# EAGLE design shield-no_ps (EAGLE 6.5.0)
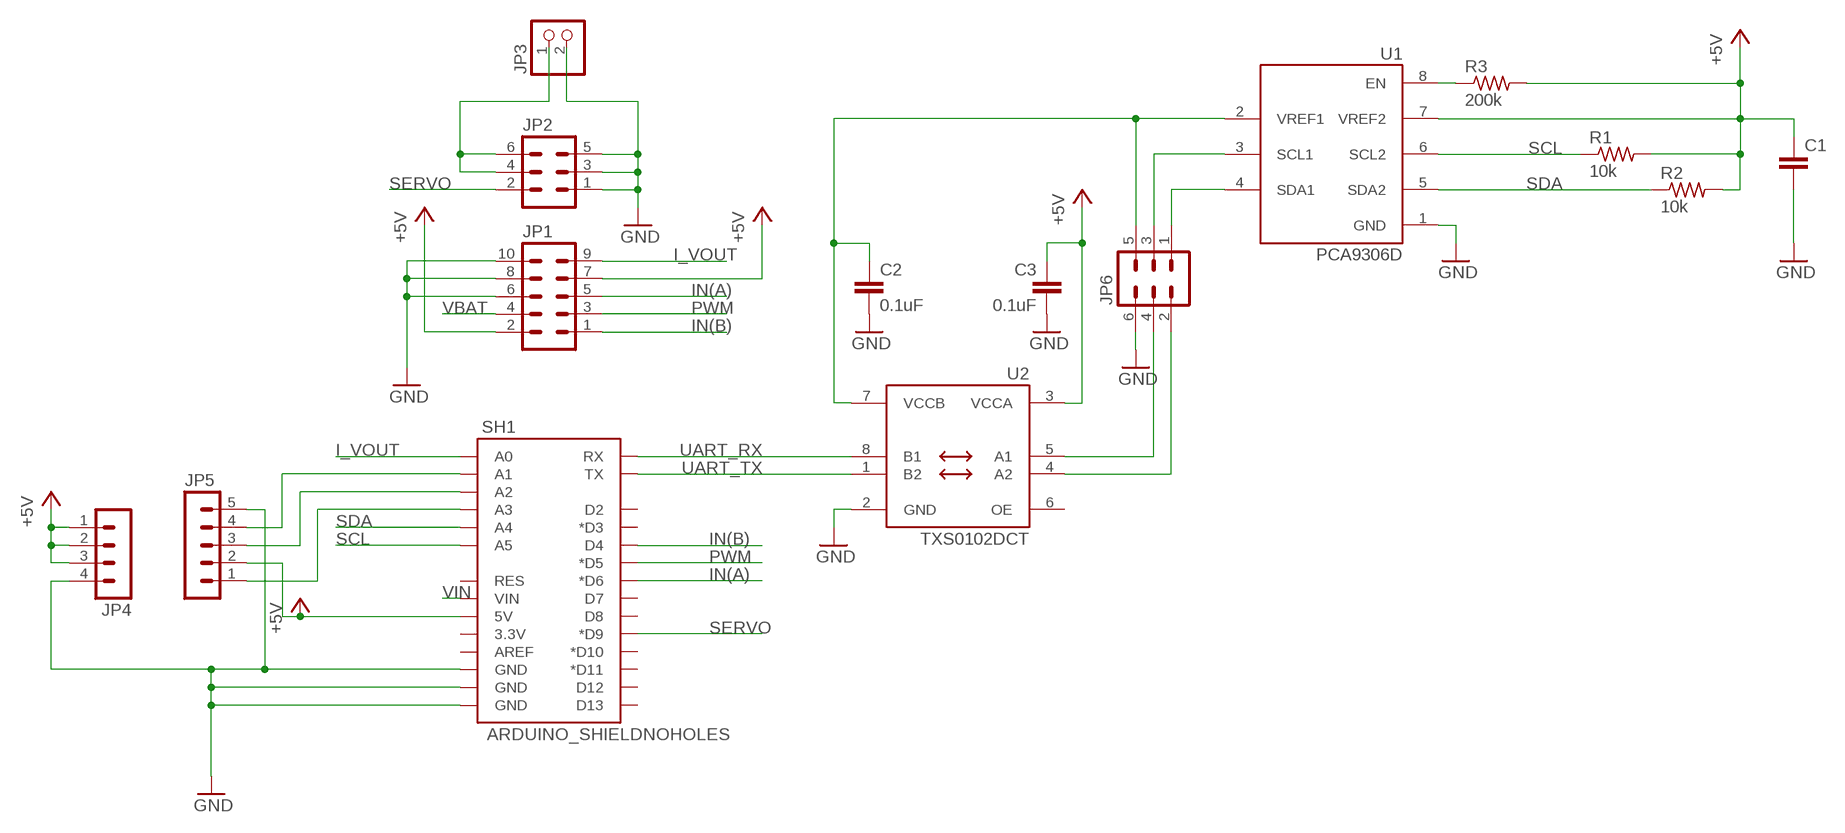
[diagram p0: schematic, sheet 1]

## Parts
C1  C-EUC0805  [C0805]
C2  0.1uF  C-EUC0603  [C0603]
C3  0.1uF  C-EUC0603  [C0603]
JP1  ML10  [ML10]
JP2  ML6  [ML6]
JP3  PINHD-1X2  [1X02]
JP4  MA04-1  [MA04-1]
JP5  MA05-1  [MA05-1]
JP6  ML6  [ML6]
R1  10k  R-US_R0805  [R0805]
R2  10k  R-US_R0805  [R0805]
R3  200k  R-US_R0603  [R0603]
SH1  ARDUINO_SHIELDNOHOLES  [DUEMILANOVE_SHIELD_NOHOLES]
U1  PCA9306D  [SO8]
U2  TXS0102DCT  [DCT_R-PDSO-G8]

## Nets
+5V: C1.1 C3.1 JP1.2 JP1.7 JP4.1 JP4.2 JP4.3 JP5.2 R1.2 R2.2 R3.2 SH1.5V U1.7(VREF2) U2.3(VCCA)
GND: C1.2 C2.2 C3.2 JP1.6 JP1.8 JP1.10 JP2.1 JP2.3 JP2.5 JP3.2 JP4.4 JP5.5 JP6.6 SH1.GND@0(GND) SH1.GND@1(GND) SH1.GND@2(GND) U1.1(GND) U2.2(GND)
I_VOUT: JP1.9 SH1.A0
IN(A): JP1.5 SH1.D6(*D6)
IN(B): JP1.1 SH1.D4
N$1: C2.1 JP6.5 U1.2(VREF1) U2.7(VCCB)
N$2: JP2.4 JP2.6 JP3.1
N$3: R3.1 U1.8(EN)
N$4: JP6.1 U1.4(SDA1)
N$5: JP6.3 U1.3(SCL1)
N$6: JP5.4 SH1.A1
N$7: JP5.3 SH1.A2
N$8: JP5.1 SH1.A3
N$9: JP6.2 U2.4(A2)
N$10: JP6.4 U2.5(A1)
PWM: JP1.3 SH1.D5(*D5)
SCL: R1.1 SH1.A5 U1.6(SCL2)
SDA: R2.1 SH1.A4 U1.5(SDA2)
SERVO: JP2.2 SH1.D9(*D9)
UART_RX: SH1.RX U2.8(B1)
UART_TX: SH1.TX U2.1(B2)
VBAT: JP1.4
VIN: SH1.VIN
Unconnected: SH1.3.3V SH1.AREF SH1.D2 SH1.D3(*D3) SH1.D7 SH1.D8 SH1.D10(*D10) SH1.D11(*D11) SH1.D12 SH1.D13 SH1.RES U2.6(OE)

## Library data of the parts
C1-C3 = rcl:C-EU: CAPACITOR, European symbol
JP1 = con-ml:ML10: HARTING; OC_FARNELL: unknown; OC_NEWARK: unknown
JP2 JP6 = con-harting-ml:ML6: HARTING; OC_FARNELL: unknown; OC_NEWARK: unknown
JP3 = pinhead:PINHD-1X2: PIN HEADER
JP4 = con-lstb:MA04-1: PIN HEADER; OC_FARNELL: unknown; OC_NEWARK: unknown
JP5 = con-lstb:MA05-1: PIN HEADER; OC_FARNELL: unknown; OC_NEWARK: unknown
R1-R3 = rcl:R-US_: RESISTOR, American symbol
SH1 = SparkFun-Boards:ARDUINO_SHIELD: Arduino shield footprint
U1 = PCA9306:PCA9306
U2 = texas-1:TXS0102

## Board
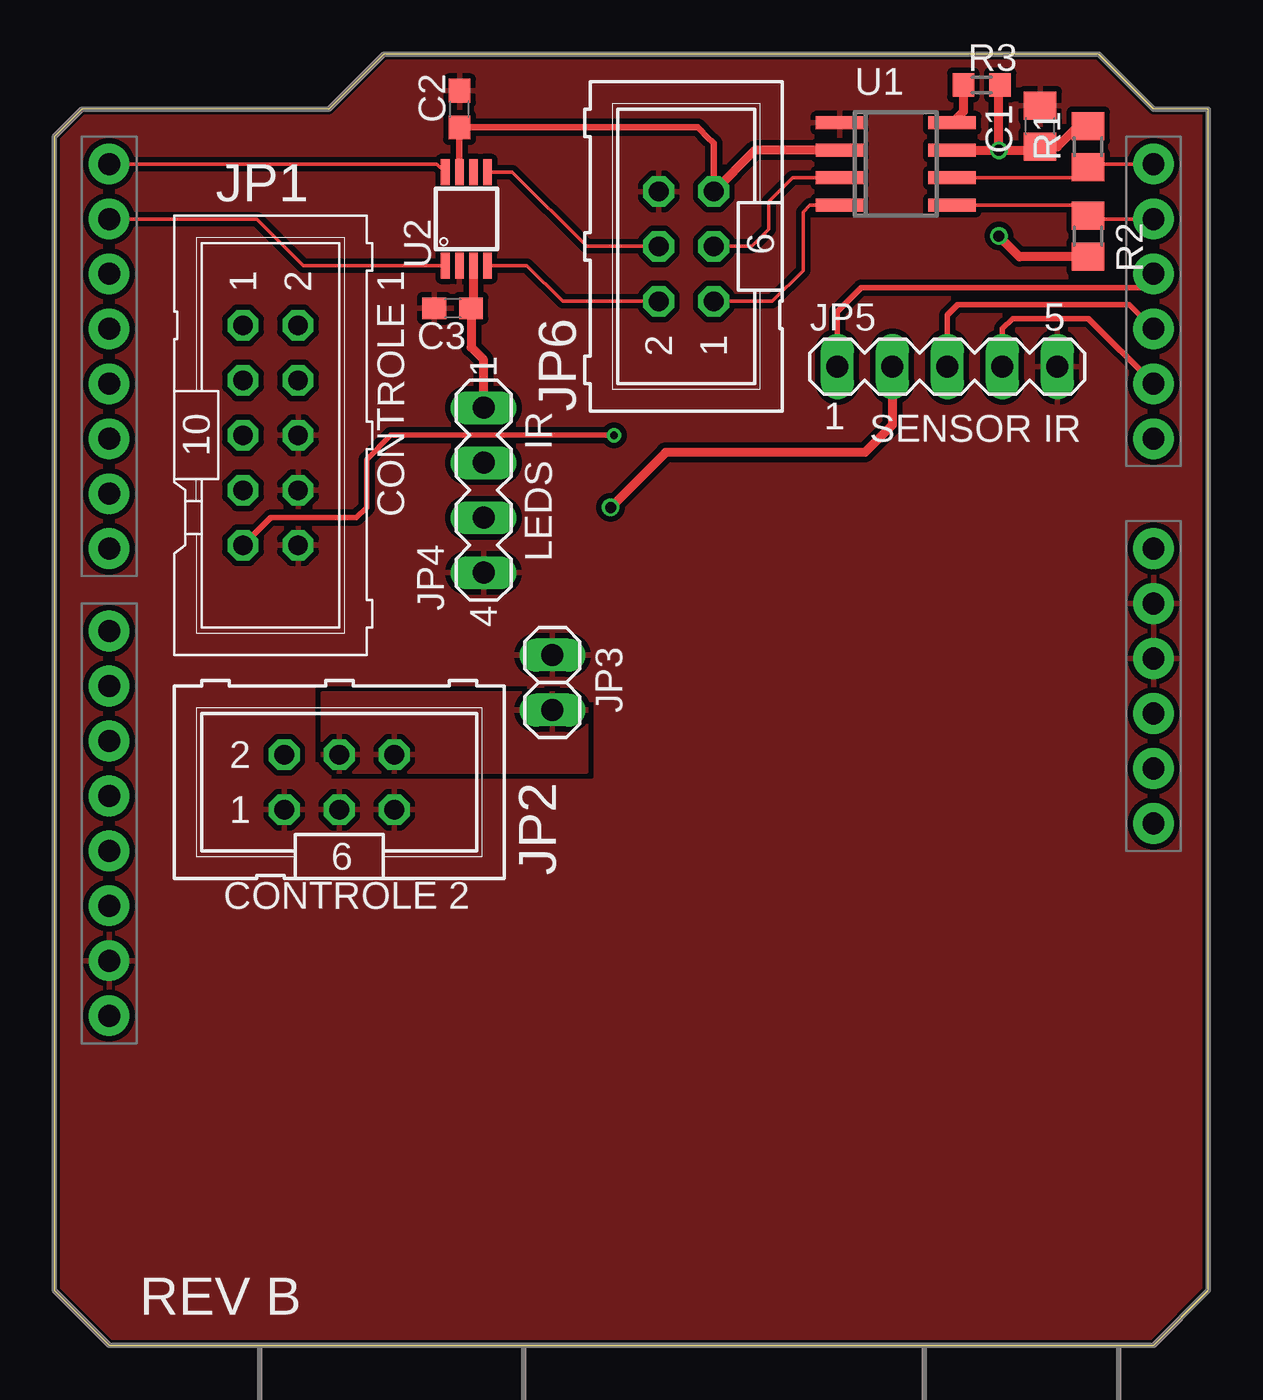
[diagram p1: board, top side]
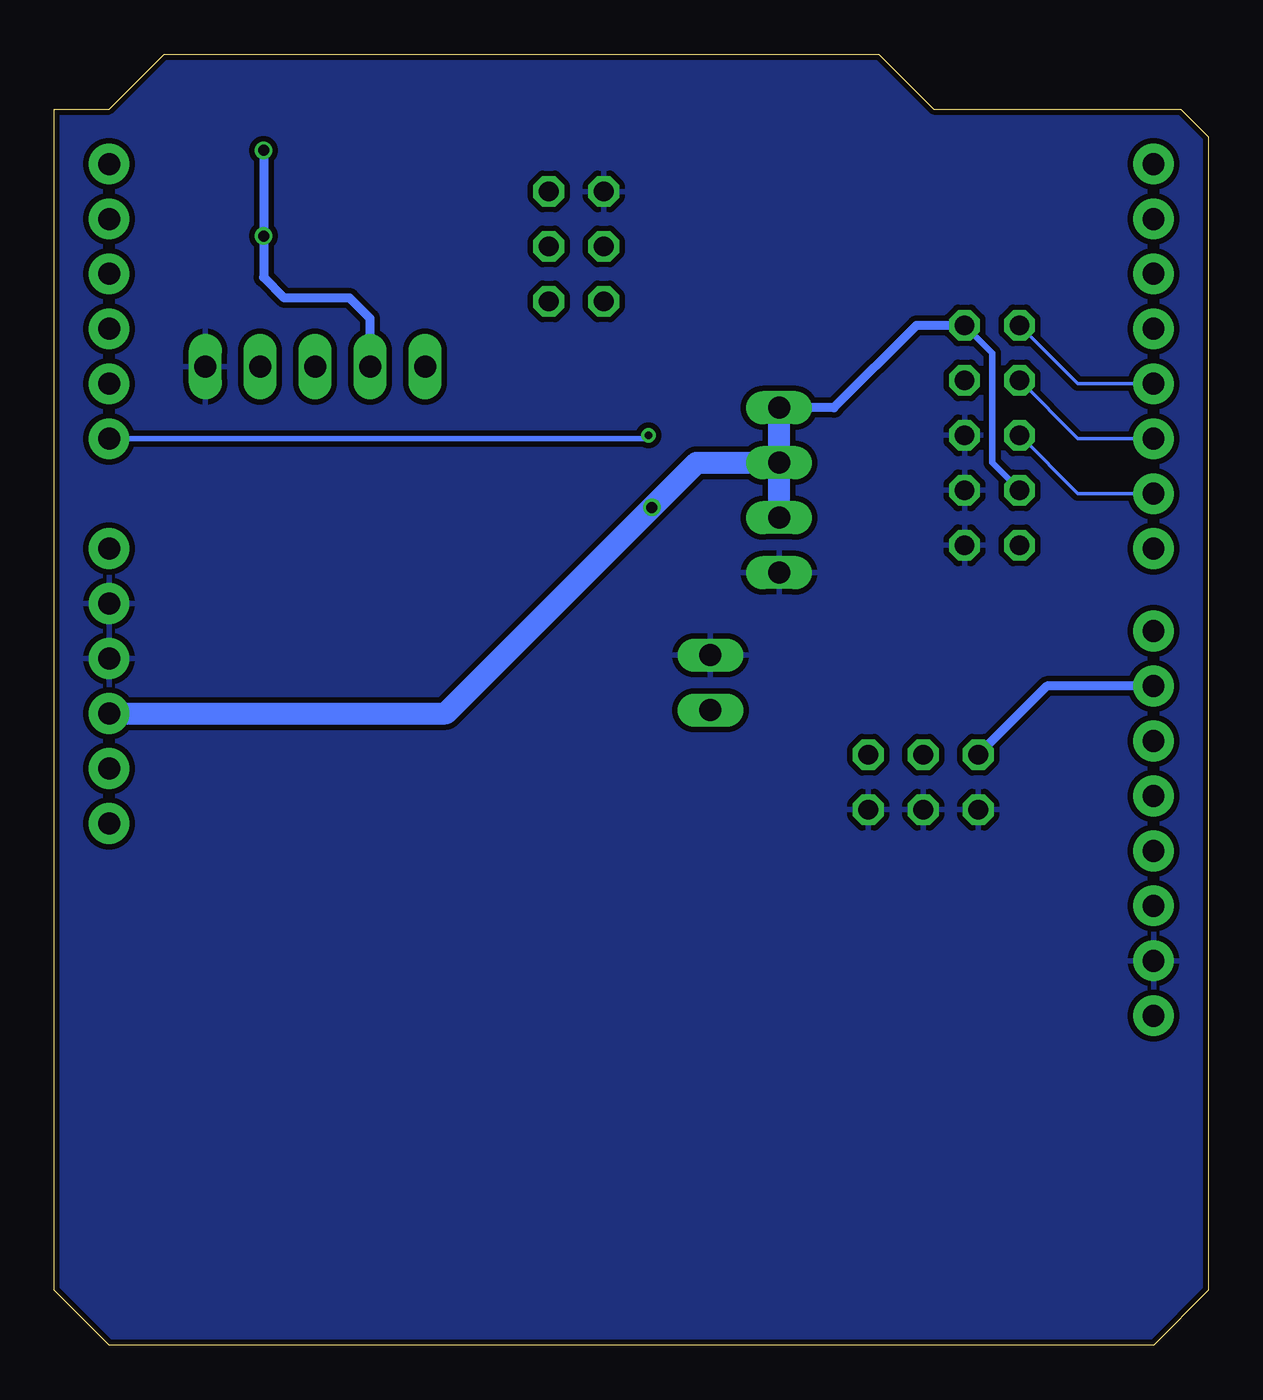
[diagram p2: board, bottom side, seen from below]

Size 53.34 x 59.69 mm. Coordinates in mm from the lower left corner, seen from the top.
Outline: 0,2.54 2.54,0 50.8,0 53.34,2.54 53.34,57.15 50.8,57.15 48.26,59.69 15.24,59.69 12.7,57.15 1.27,57.15 0,55.88 0,2.54
Copper layers (1*16): Top 0.035mm / dielectric 1.5mm / Bottom 0.035mm
Design rules "ITEADstudio_DRC": minimum track width 6mil, minimum drill 12mil, track to track 6mil, track to pad 6mil, pad to pad 6mil, via to via 6mil, smd to smd 0mil, copper to edge 10mil, drill to drill 10mil, minimum pad ring 10mil, minimum via ring 6mil, stop-mask expansion 2mil, vias tented up to drill 100mil, thermal gap 10mil

### Footprints (pad centres in the part's own frame; a part is rotated, then mirrored left to right if it is on the bottom)
C0805 = smd 1.3 x 1.5: 1 -0.95,0; 2 0.95,0
C0603 = smd 1.1 x 1: 1 -0.85,0; 2 0.85,0
ML10 = drill 0.914 octagon: 1 -5.08,-1.27; 2 -5.08,1.27; 3 -2.54,-1.27; 4 -2.54,1.27; 5 0,-1.27; 6 0,1.27; 7 2.54,-1.27; 8 2.54,1.27; 9 5.08,-1.27; 10 5.08,1.27
ML6 = drill 0.914 octagon: 1 -2.54,-1.27; 2 -2.54,1.27; 3 0,-1.27; 4 0,1.27; 5 2.54,-1.27; 6 2.54,1.27
1X02 = drill 1.016 long: 1 -1.27,0; 2 1.27,0
MA04-1 = drill 1.016 long: 1 -3.81,0; 2 -1.27,0; 3 1.27,0; 4 3.81,0
MA05-1 = drill 1.016 long: 1 -5.08,0; 2 -2.54,0; 3 0,0; 4 2.54,0; 5 5.08,0
R0805 = smd 1.3 x 1.5: 1 -0.95,0; 2 0.95,0
R0603 = smd 1 x 1.1: 1 -0.85,0; 2 0.85,0
DUEMILANOVE_SHIELD_NOHOLES = drill 1.016 pad 1.88: 3.3V 50.8,26.67; 5V 50.8,29.21; A0 50.8,41.91; A1 50.8,44.45; A2 50.8,46.99; A3 50.8,49.53; A4 50.8,52.07; A5 50.8,54.61; AREF 2.54,15.24; D2 2.54,49.53; D3 2.54,46.99; D4 2.54,44.45; D5 2.54,41.91; D6 2.54,39.37; D7 2.54,36.83; D8 2.54,33.02; D9 2.54,30.48; D10 2.54,27.94; D11 2.54,25.4; D12 2.54,22.86; D13 2.54,20.32; GND@0 50.8,31.75; GND@1 50.8,34.29; GND@2 2.54,17.78; RES 50.8,24.13; RX 2.54,54.61; TX 2.54,52.07; VIN 50.8,36.83
SO8 = smd 0.6 x 2.2: 1 -1.905,-2.6; 2 -0.635,-2.6; 3 0.635,-2.6; 4 1.905,-2.6; 5 1.905,2.6; 6 0.635,2.6; 7 -0.635,2.6; 8 -1.905,2.6
DCT_R-PDSO-G8 = smd 0.4 x 1.2: 1 -0.975,-2.157; 2 -0.325,-2.157; 3 0.325,-2.157; 4 0.975,-2.157; 5 0.975,2.157; 6 0.325,2.157; 7 -0.325,2.157; 8 -0.975,2.157

### Placement (x,y rotation side)
C1  45.56,56.36 90 top
C2  18.73,57.15 90 top
C3  18.41,47.94 180 top
JP1  10,42.07 270 top
JP2  13.18,26.04 0 top
JP3  23.02,30.64 90 top
JP4  19.84,39.53 270 top
JP5  41.27,45.24 0 top
JP6  29.21,50.8 90 top
R1  47.78,55.4 90 top
R2  47.78,51.28 270 top
R3  42.86,58.26 0 top
SH1  0,0 0 top
U1  38.89,54.61 270 top
U2  19.05,52.07 0 top

### Tracks (layer width: path | path; a pad name or v marks a point on that pad's centre or on a via)
+5V  (via drill 0.5)
  Top 0.406: U1.7 v43.66,55.24 | v43.66,55.24 45.4,55.24 C1.1 46.35,55.4 47.3,56.35 R1.2 | v43.66,55.24 43.66,58.2 R3.2 | R2.2 44.61,50.33 v43.66,51.28 | JP4.1 19.84,45.56 19.27,46.14 C3.1 19.38,48.05 U2.3 | JP5.2 38.73,42.55 37.47,41.27 28.26,41.27 v25.72,38.73
  Bottom 0.305: JP1.7 10,40.8 10,45.88 JP1.2
  Bottom 0.406: v43.66,55.24 v43.66,51.28 43.66,49.37 42.7,48.42 39.69,48.42 38.73,47.47 JP5.2 | JP1.2 13.49,47.15 17.3,43.34 JP4.1
  Bottom 1.016: SH1.5V 35.24,29.21 v25.72,38.73 25.4,39.05 23.65,40.8 JP4.2 | JP4.3 JP4.2 | JP4.2 JP4.1
GND
  pour Bottom (isolate 0.254, rank 6): 0,2.54 2.54,0 50.8,0 53.34,2.54 53.34,57.15 50.8,57.15 48.26,59.69 15.24,59.69 12.7,57.15 1.27,57.15 0,55.88
  pour Top (isolate 0.254, rank 6): 0,2.54 2.54,0 50.8,0 53.34,2.54 53.34,57.15 50.8,57.15 48.26,59.69 15.24,59.69 12.7,57.15 1.27,57.15 0,55.88
I_VOUT  (via drill 0.36)
  Top 0.254: v25.88,42.07 15.56,42.07 14.45,40.96 14.45,38.73 13.97,38.26 10,38.26 JP1.9
  Bottom 0.254: SH1.A0 26.04,41.91 v25.88,42.07
IN(A)
  Bottom 0.152: SH1.D6 6.03,39.37 JP1.5
IN(B)
  Bottom 0.152: SH1.D4 6.03,44.45 JP1.1
N$1
  Top 0.305: U2.7 C2.1 29.74,56.3 29.84,56.2 30.16,55.88 30.48,55.56 JP6.5
  Top 0.406: U1.2 32.38,55.24 JP6.5
N$2
  pour Top: 12.86,26.51 24.61,26.51 24.61,30.16 12.38,30.16 12.38,26.51
N$3
  Top 0.406: R3.1 42.01,57.03 U1.8
N$4
  Top 0.152: JP6.1 33.18,48.26 34.61,49.69 34.61,52.39 34.92,52.7 U1.4
N$5
  Top 0.152: U1.3 34.13,53.98 33.02,52.86 33.02,51.59 32.23,50.8 JP6.3
N$6
  Top 0.254: JP5.4 43.81,46.99 44.29,47.47 47.78,47.47 SH1.A1
N$7
  Top 0.254: JP5.3 41.27,47.62 41.75,48.1 49.69,48.1 SH1.A2
N$8
  Top 0.254: JP5.1 36.2,47.78 37.31,48.9 50.16,48.9 SH1.A3
N$9
  Top 0.152: JP6.2 23.5,48.26 21.84,49.91 U2.4
N$10
  Top 0.152: JP6.4 24.61,50.8 21.18,54.23 U2.5
PWM
  Bottom 0.152: SH1.D5 6.03,41.91 JP1.3
SCL
  Top 0.152: U1.6 47.3,53.98 R1.1 47.94,54.61 SH1.A5
SDA
  Top 0.152: SH1.A4 47.94,52.07 R2.1 47.3,52.7 U1.5
SERVO
  Bottom 0.406: SH1.D9 7.46,30.48 JP2.2
UART_RX
  Top 0.152: SH1.RX 17.69,54.61 U2.8
UART_TX
  Top 0.152: SH1.TX 9.37,52.07 11.52,49.91 U2.1

### Text on the board
tPlace: CONTROLE 1 | LEDS IR | SENSOR IR | CONTROLE 2 | REV B